# EAGLE schematic PowerBoard_v9 (EAGLE 9.7.0)
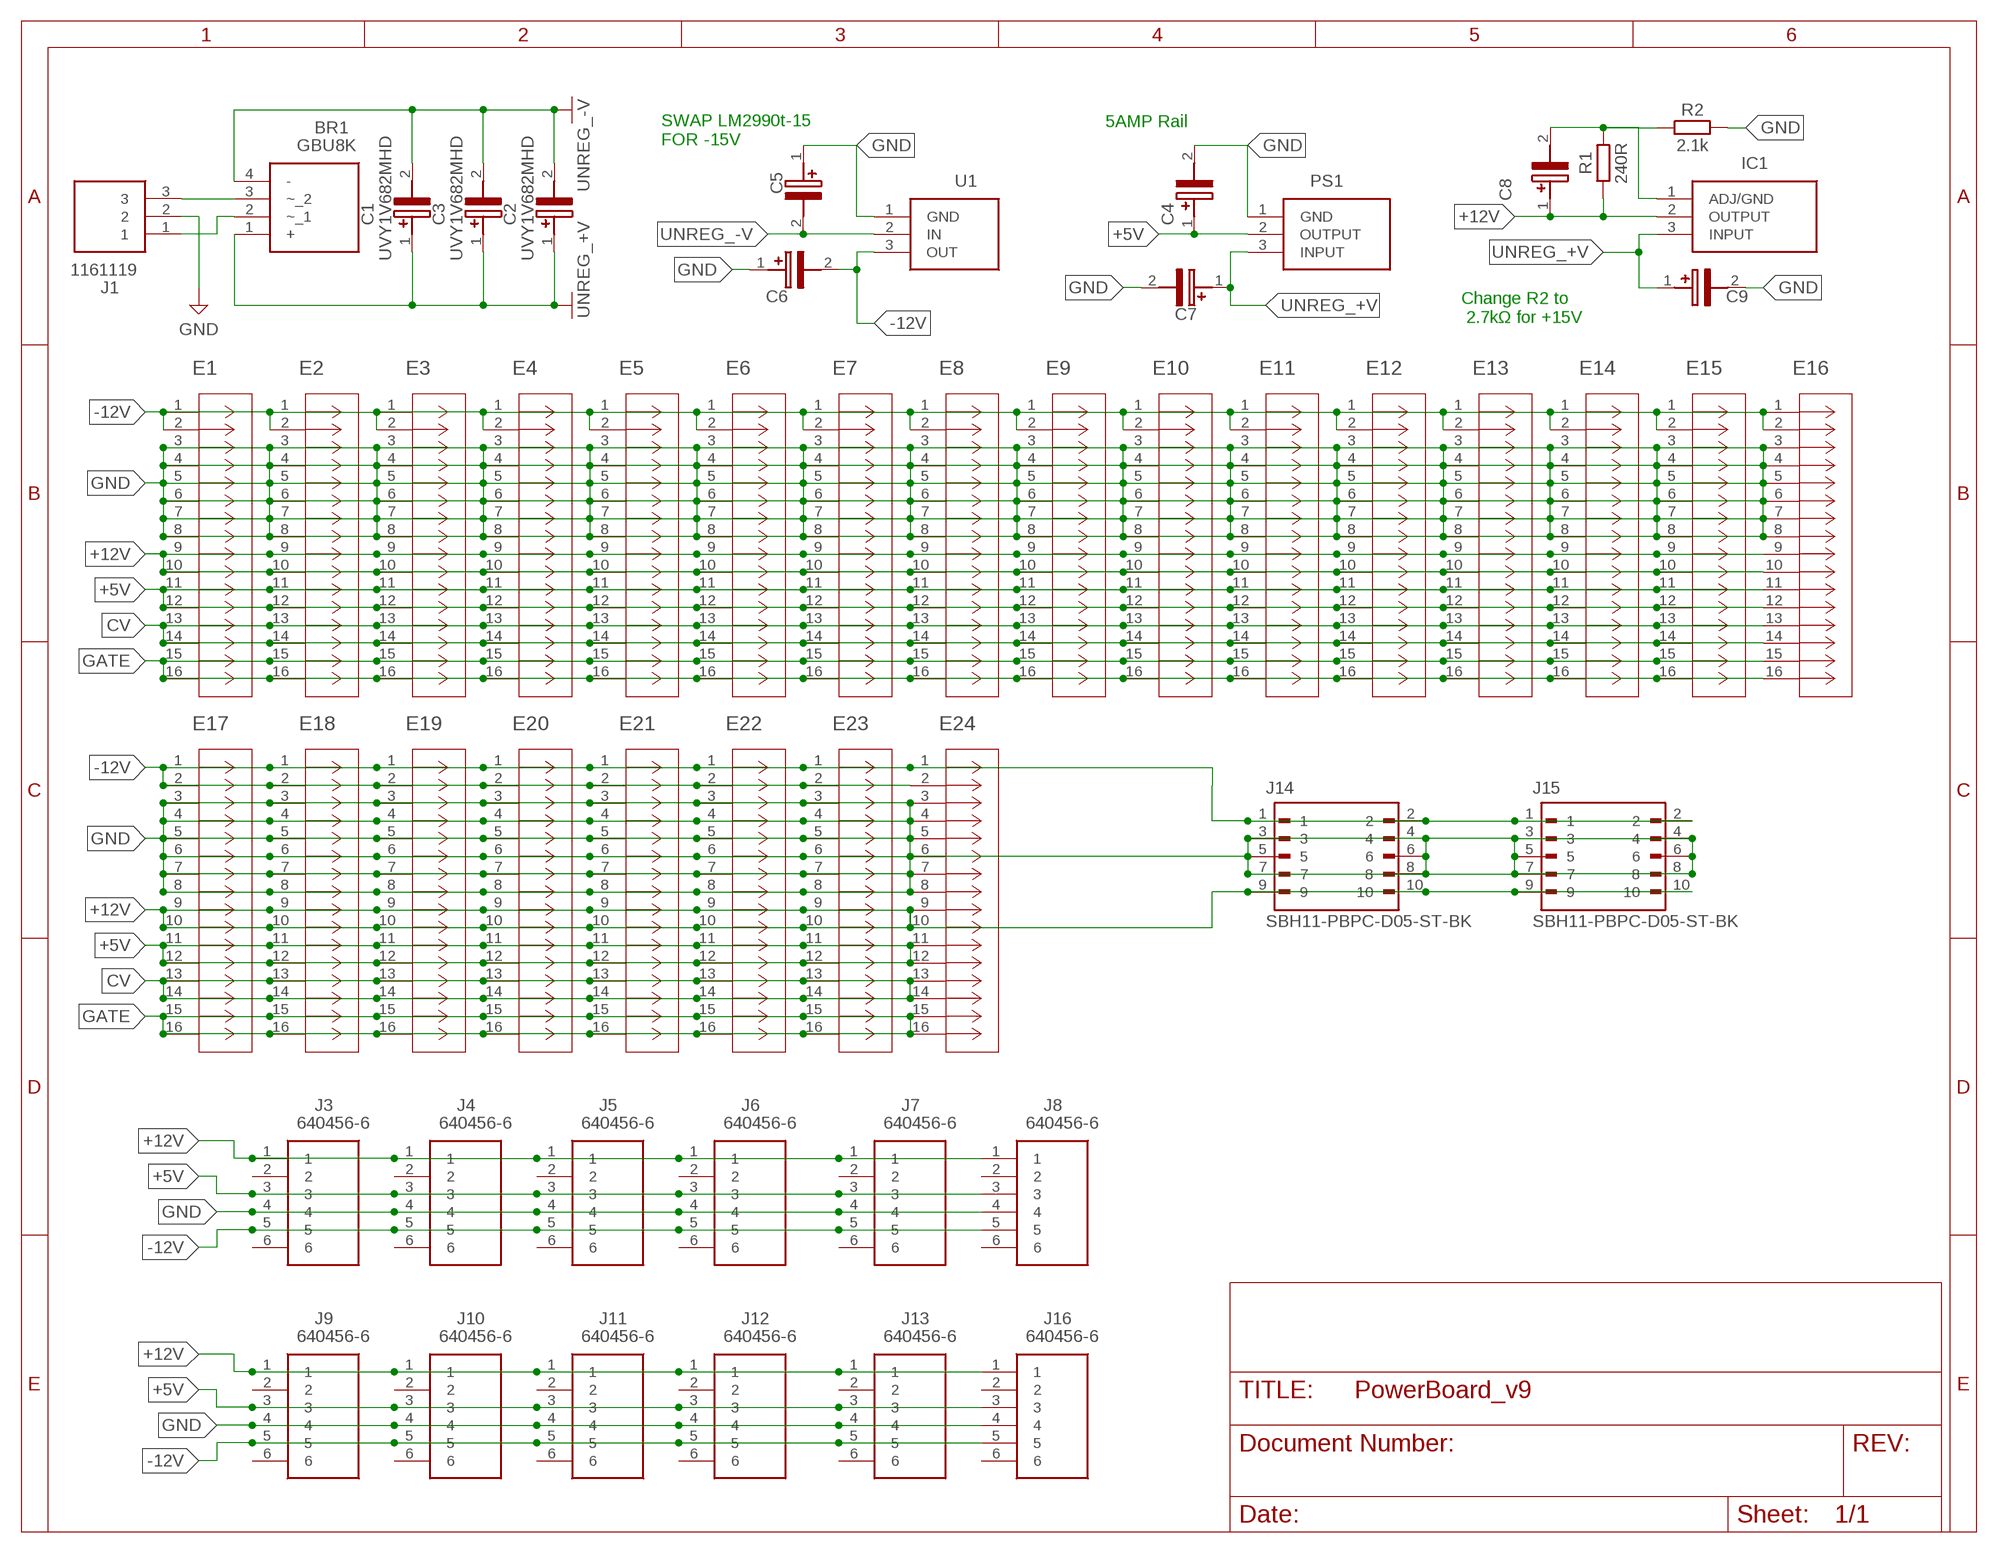
[diagram p0: schematic, sheet 1]

## Parts
BR1  GBU8K  [GBU8K]
C1  UVY1V682MHD  [CAPPRD750W80D1825H4200]
C2  UVY1V682MHD  [CAPPRD750W80D1825H4200]
C3  UVY1V682MHD  [CAPPRD750W80D1825H4200]
C4  UEP1V101MPD  [CAPPRD500W60D1025H1750]
C5  UEP1V101MPD  [CAPPRD500W60D1025H1750]
C6  UEP1V101MPD  [CAPPRD500W60D1025H1750]
C7  UEP1V101MPD  [CAPPRD500W60D1025H1750]
C8  UEP1V101MPD  [CAPPRD500W60D1025H1750]
C9  UEP1V101MPD  [CAPPRD500W60D1025H1750]
E1  SBH11-PBPC-D08-ST-BKCONN16_SBH11-PBPC-D08-ST-BK_SU  [CONN16_SBH11-PBPC-D08-ST-BK_SU]
E2  SBH11-PBPC-D08-ST-BKCONN16_SBH11-PBPC-D08-ST-BK_SU  [CONN16_SBH11-PBPC-D08-ST-BK_SU]
E3  SBH11-PBPC-D08-ST-BKCONN16_SBH11-PBPC-D08-ST-BK_SU  [CONN16_SBH11-PBPC-D08-ST-BK_SU]
E4  SBH11-PBPC-D08-ST-BKCONN16_SBH11-PBPC-D08-ST-BK_SU  [CONN16_SBH11-PBPC-D08-ST-BK_SU]
E5  SBH11-PBPC-D08-ST-BKCONN16_SBH11-PBPC-D08-ST-BK_SU  [CONN16_SBH11-PBPC-D08-ST-BK_SU]
E6  SBH11-PBPC-D08-ST-BKCONN16_SBH11-PBPC-D08-ST-BK_SU  [CONN16_SBH11-PBPC-D08-ST-BK_SU]
E7  SBH11-PBPC-D08-ST-BKCONN16_SBH11-PBPC-D08-ST-BK_SU  [CONN16_SBH11-PBPC-D08-ST-BK_SU]
E8  SBH11-PBPC-D08-ST-BKCONN16_SBH11-PBPC-D08-ST-BK_SU  [CONN16_SBH11-PBPC-D08-ST-BK_SU]
E9  SBH11-PBPC-D08-ST-BKCONN16_SBH11-PBPC-D08-ST-BK_SU  [CONN16_SBH11-PBPC-D08-ST-BK_SU]
E10  SBH11-PBPC-D08-ST-BKCONN16_SBH11-PBPC-D08-ST-BK_SU  [CONN16_SBH11-PBPC-D08-ST-BK_SU]
E11  SBH11-PBPC-D08-ST-BKCONN16_SBH11-PBPC-D08-ST-BK_SU  [CONN16_SBH11-PBPC-D08-ST-BK_SU]
E12  SBH11-PBPC-D08-ST-BKCONN16_SBH11-PBPC-D08-ST-BK_SU  [CONN16_SBH11-PBPC-D08-ST-BK_SU]
E13  SBH11-PBPC-D08-ST-BKCONN16_SBH11-PBPC-D08-ST-BK_SU  [CONN16_SBH11-PBPC-D08-ST-BK_SU]
E14  SBH11-PBPC-D08-ST-BKCONN16_SBH11-PBPC-D08-ST-BK_SU  [CONN16_SBH11-PBPC-D08-ST-BK_SU]
E15  SBH11-PBPC-D08-ST-BKCONN16_SBH11-PBPC-D08-ST-BK_SU  [CONN16_SBH11-PBPC-D08-ST-BK_SU]
E16  SBH11-PBPC-D08-ST-BKCONN16_SBH11-PBPC-D08-ST-BK_SU  [CONN16_SBH11-PBPC-D08-ST-BK_SU]
E17  SBH11-PBPC-D08-ST-BKCONN16_SBH11-PBPC-D08-ST-BK_SU  [CONN16_SBH11-PBPC-D08-ST-BK_SU]
E18  SBH11-PBPC-D08-ST-BKCONN16_SBH11-PBPC-D08-ST-BK_SU  [CONN16_SBH11-PBPC-D08-ST-BK_SU]
E19  SBH11-PBPC-D08-ST-BKCONN16_SBH11-PBPC-D08-ST-BK_SU  [CONN16_SBH11-PBPC-D08-ST-BK_SU]
E20  SBH11-PBPC-D08-ST-BKCONN16_SBH11-PBPC-D08-ST-BK_SU  [CONN16_SBH11-PBPC-D08-ST-BK_SU]
E21  SBH11-PBPC-D08-ST-BKCONN16_SBH11-PBPC-D08-ST-BK_SU  [CONN16_SBH11-PBPC-D08-ST-BK_SU]
E22  SBH11-PBPC-D08-ST-BKCONN16_SBH11-PBPC-D08-ST-BK_SU  [CONN16_SBH11-PBPC-D08-ST-BK_SU]
E23  SBH11-PBPC-D08-ST-BKCONN16_SBH11-PBPC-D08-ST-BK_SU  [CONN16_SBH11-PBPC-D08-ST-BK_SU]
E24  SBH11-PBPC-D08-ST-BKCONN16_SBH11-PBPC-D08-ST-BK_SU  [CONN16_SBH11-PBPC-D08-ST-BK_SU]
IC1  LM1084IT-ADJ_NOPB  [TO254P470X1028X1955-3P]
J1  1161119  [1161119]
J3  640456-6  [SHDR6W66P0X254_1X6_1524X572X10]
J4  640456-6  [SHDR6W66P0X254_1X6_1524X572X10]
J5  640456-6  [SHDR6W66P0X254_1X6_1524X572X10]
J6  640456-6  [SHDR6W66P0X254_1X6_1524X572X10]
J7  640456-6  [SHDR6W66P0X254_1X6_1524X572X10]
J8  640456-6  [SHDR6W66P0X254_1X6_1524X572X10]
J9  640456-6  [SHDR6W66P0X254_1X6_1524X572X10]
J10  640456-6  [SHDR6W66P0X254_1X6_1524X572X10]
J11  640456-6  [SHDR6W66P0X254_1X6_1524X572X10]
J12  640456-6  [SHDR6W66P0X254_1X6_1524X572X10]
J13  640456-6  [SHDR6W66P0X254_1X6_1524X572X10]
J14  SBH11-PBPC-D05-ST-BK  [SULLINS_SBH11-PBPC-D05-ST-BK]
J15  SBH11-PBPC-D05-ST-BK  [SULLINS_SBH11-PBPC-D05-ST-BK]
J16  640456-6  [SHDR6W66P0X254_1X6_1524X572X10]
PS1  LM1084IT-5.0_NOPB  [TO254P470X1028X1955-3P]
R1  240R  RESISTOR__AXIAL-7.2MM-PITCH  [RESAD724W46L381D178B]
R2  2.1k  RESISTOR__AXIAL-7.2MM-PITCH  [RESAD724W46L381D178B]
U1  LM2990T-12_NOPB  [TO254P470X1028X1955-3P]

## Nets
+5V: C4.1(+) E1.11 E1.12 E2.11 E2.12 E3.11 E3.12 E4.11 E4.12 E5.11 E5.12 E6.11 E6.12 E7.11 E7.12 E8.11 E8.12 E9.11 E9.12 E10.11 E10.12 E11.11 E11.12 E12.11 E12.12 E13.11 E13.12 E14.11 E14.12 E15.11 E15.12 E16.11 E16.12 E17.11 E17.12 E18.11 E18.12 E19.11 E19.12 E20.11 E20.12 E21.11 E21.12 E22.11 E22.12 E23.11 E23.12 E24.11 E24.12 J3.3 J4.3 J5.3 J6.3 J7.3 J8.3 J9.3 J10.3 J11.3 J12.3 J13.3 J16.3 PS1.2(OUTPUT)
+12V: C8.1(+) E1.9 E1.10 E2.9 E2.10 E3.9 E3.10 E4.9 E4.10 E5.9 E5.10 E6.9 E6.10 E7.9 E7.10 E8.9 E8.10 E9.9 E9.10 E10.9 E10.10 E11.9 E11.10 E12.9 E12.10 E13.9 E13.10 E14.9 E14.10 E15.9 E15.10 E16.9 E16.10 E17.9 E17.10 E18.9 E18.10 E19.9 E19.10 E20.9 E20.10 E21.9 E21.10 E22.9 E22.10 E23.9 E23.10 E24.9 E24.10 IC1.2(OUTPUT) J3.1 J4.1 J5.1 J6.1 J7.1 J8.1 J9.1 J10.1 J11.1 J12.1 J13.1 J14.9 J14.10 J15.9 J15.10 J16.1 R1.1
-12V: C6.2(-) E1.1 E1.2 E2.1 E2.2 E3.1 E3.2 E4.1 E4.2 E5.1 E5.2 E6.1 E6.2 E7.1 E7.2 E8.1 E8.2 E9.1 E9.2 E10.1 E10.2 E11.1 E11.2 E12.1 E12.2 E13.1 E13.2 E14.1 E14.2 E15.1 E15.2 E16.1 E16.2 E17.1 E17.2 E18.1 E18.2 E19.1 E19.2 E20.1 E20.2 E21.1 E21.2 E22.1 E22.2 E23.1 E23.2 E24.1 E24.2 J3.5 J4.5 J5.5 J6.5 J7.5 J8.5 J9.5 J10.5 J11.5 J12.5 J13.5 J14.1 J14.2 J15.1 J15.2 J16.5 U1.3(OUT)
CV: E1.13 E1.14 E2.13 E2.14 E3.13 E3.14 E4.13 E4.14 E5.13 E5.14 E6.13 E6.14 E7.13 E7.14 E8.13 E8.14 E9.13 E9.14 E10.13 E10.14 E11.13 E11.14 E12.13 E12.14 E13.13 E13.14 E14.13 E14.14 E15.13 E15.14 E16.13 E16.14 E17.13 E17.14 E18.13 E18.14 E19.13 E19.14 E20.13 E20.14 E21.13 E21.14 E22.13 E22.14 E23.13 E23.14 E24.13 E24.14
GATE: E1.15 E1.16 E2.15 E2.16 E3.15 E3.16 E4.15 E4.16 E5.15 E5.16 E6.15 E6.16 E7.15 E7.16 E8.15 E8.16 E9.15 E9.16 E10.15 E10.16 E11.15 E11.16 E12.15 E12.16 E13.15 E13.16 E14.15 E14.16 E15.15 E15.16 E16.15 E16.16 E17.15 E17.16 E18.15 E18.16 E19.15 E19.16 E20.15 E20.16 E21.15 E21.16 E22.15 E22.16 E23.15 E23.16 E24.15 E24.16
GND: C4.2(-) C5.1(+) C6.1(+) C7.2(-) C9.2(-) E1.3 E1.4 E1.5 E1.6 E1.7 E1.8 E2.3 E2.4 E2.5 E2.6 E2.7 E2.8 E3.3 E3.4 E3.5 E3.6 E3.7 E3.8 E4.3 E4.4 E4.5 E4.6 E4.7 E4.8 E5.3 E5.4 E5.5 E5.6 E5.7 E5.8 E6.3 E6.4 E6.5 E6.6 E6.7 E6.8 E7.3 E7.4 E7.5 E7.6 E7.7 E7.8 E8.3 E8.4 E8.5 E8.6 E8.7 E8.8 E9.3 E9.4 E9.5 E9.6 E9.7 E9.8 E10.3 E10.4 E10.5 E10.6 E10.7 E10.8 E11.3 E11.4 E11.5 E11.6 E11.7 E11.8 E12.3 E12.4 E12.5 E12.6 E12.7 E12.8 E13.3 E13.4 E13.5 E13.6 E13.7 E13.8 E14.3 E14.4 E14.5 E14.6 E14.7 E14.8 E15.3 E15.4 E15.5 E15.6 E15.7 E15.8 E16.3 E16.4 E16.5 E16.6 E16.7 E16.8 E17.3 E17.4 E17.5 E17.6 E17.7 E17.8 E18.3 E18.4 E18.5 E18.6 E18.7 E18.8 E19.3 E19.4 E19.5 E19.6 E19.7 E19.8 E20.3 E20.4 E20.5 E20.6 E20.7 E20.8 E21.3 E21.4 E21.5 E21.6 E21.7 E21.8 E22.3 E22.4 E22.5 E22.6 E22.7 E22.8 E23.3 E23.4 E23.5 E23.6 E23.7 E23.8 E24.3 E24.4 E24.5 E24.6 E24.7 E24.8 J1.2 J3.4 J4.4 J5.4 J6.4 J7.4 J8.4 J9.4 J10.4 J11.4 J12.4 J13.4 J14.3 J14.4 J14.5 J14.6 J14.7 J14.8 J15.3 J15.4 J15.5 J15.6 J15.7 J15.8 J16.4 PS1.1(GND) R2.2 U1.1(GND)
N$1: BR1.3(~_2) J1.3
N$2: BR1.2(~_1) J1.1
N$4: C8.2(-) IC1.1(ADJ/GND) R1.2 R2.1
UNREG_+V: BR1.1(+) C1.1(+) C2.1(+) C3.1(+) C7.1(+) C9.1(+) IC1.3(INPUT) PS1.3(INPUT)
UNREG_-V: BR1.4(-) C1.2(-) C2.2(-) C3.2(-) C5.2(-) U1.2(IN)
Unconnected: J3.2 J3.6 J4.2 J4.6 J5.2 J5.6 J6.2 J6.6 J7.2 J7.6 J8.2 J8.6 J9.2 J9.6 J10.2 J10.6 J11.2 J11.6 J12.2 J12.6 J13.2 J13.6 J16.2 J16.6

## Notes on the sheet
- 5AMP Rail
- SWAP LM2990t-15
  FOR -15V
- Change R2 to
   2.7kΩ for +15V

## Library data of the parts
BR1 = GBU8K:GBU8K: Glass-Passivated Junction; Reliable Low-Cost Construction Utilizing Molded Plastic Technique; Ideal for Printed Circuit Bboard; UL certified, UL #E258596; Surge Overload Rating: 200 A peak Source: Datasheet <https://www.onsemi.com/pub/Collateral/GBU8B-D.PDF>; DESCRIPTION: Glass-Passivated Junction; Reliable Low-Cost Construction Utilizing Molded Plastic Technique; Ideal for Printed Circuit Bboard; UL certified, UL #E258596; Surge Overload Rating: 200 A peak; HEIGHT: 18.8mm; MANUFACTURER_NAME: onsemi; MANUFACTURER_PART_NUMBER: GBU8K; MOUSER_PART_NUMBER: 512-GBU8K; MOUSER_PRICE-STOCK: https://www.mouser.co.uk/ProductDetail/onsemi-Fairchild/GBU8K?qs=y841m8McC1Zm%2F8rGO9q6tw%3D%3D
C1-C3 = UVY1V682MHD:UVY1V682MHD: Aluminum Electrolytic Capacitors - Radial Leaded 35volts 6800uF 18x40 20% 7.5LS Source: Datasheet <https://www.nichicon.co.jp/english/series_items/catalog_pdf/e-uvy.pdf>; DESCRIPTION: Aluminum Electrolytic Capacitors - Radial Leaded 35volts 6800uF 18x40 20% 7.5LS; HEIGHT: 42mm; MANUFACTURER_NAME: Nichicon; MANUFACTURER_PART_NUMBER: UVY1V682MHD; MOUSER_PART_NUMBER: 647-UVY1V682MHD; MOUSER_PRICE-STOCK: https://www.mouser.co.uk/ProductDetail/Nichicon/UVY1V682MHD?qs=03MsczUQpDSvOkW22EYEfQ%3D%3D
C4-C9 = UEP1V101MPD:UEP1V101MPD: Aluminum Electrolytic Capacitors - Radial Leaded 35volts 100uF 0.2L/S Source: Datasheet; DESCRIPTION: Aluminum Electrolytic Capacitors - Radial Leaded 35volts 100uF 0.2L/S; HEIGHT: 17.5mm; MANUFACTURER_NAME: Nichicon; MANUFACTURER_PART_NUMBER: UEP1V101MPD; MOUSER_PART_NUMBER: 647-UEP1V101MPD; MOUSER_PRICE-STOCK: https://www.mouser.co.uk/ProductDetail/Nichicon/UEP1V101MPD?qs=bwWQAIe1w651dkL62BtnuQ%3D%3D
E1-E24 = 2025-05-25_01-48-17_Library:SBH11-PBPC-D08-ST-BK; COPYRIGHT: Copyright (C) 2025 Ultra Librarian. All rights reserved.; MANUFACTURER_PART_NUMBER: SBH11-PBPC-D08-ST-BK; MFR_NAME: Sullins; TYPE: Headers, Male Pins
IC1 = LM1084IT-ADJ_NOPB:LM1084IT-ADJ_NOPB: 5A Fixed / Adjustable Output Linear Regulator Source: Datasheet <http://www.ti.com/lit/gpn/lm1084>; DESCRIPTION: 5A Fixed / Adjustable Output Linear Regulator; HEIGHT: 4.7mm; MANUFACTURER_NAME: Texas Instruments; MANUFACTURER_PART_NUMBER: LM1084IT-ADJ/NOPB; MOUSER_PART_NUMBER: 926-LM1084IT-ADJNOPB; MOUSER_PRICE-STOCK: https://www.mouser.co.uk/ProductDetail/Texas-Instruments/LM1084IT-ADJ-NOPB?qs=X1J7HmVL2ZFnaHQkkplutQ%3D%3D
J1 = 1161119:1161119: Pluggable Terminal Blocks MKDSN 1,5/ 3-5,08 MCBD:+-S Source: Datasheet <http://www.phoenixcontact.net/product/1161119>; DESCRIPTION: Pluggable Terminal Blocks MKDSN 1,5/ 3-5,08 MCBD:+-S; HEIGHT: 10.15mm; MANUFACTURER_NAME: Phoenix Contact; MANUFACTURER_PART_NUMBER: 1161119; MOUSER_PART_NUMBER: 651-1161119; MOUSER_PRICE-STOCK: https://www.mouser.co.uk/ProductDetail/Phoenix-Contact/1161119?qs=Wj%2FVkw3K%252BMBiMbL7Hej3PA%3D%3D
J3-J13 J16 = 640456-6:640456-6: Body Features: Primary Product Color Natural | Configuration Features: Number of Rows 1 | Number of Columns 6 | PCB Mount Orientation Vertical | Number of Positions 6 | Contact Features: Contact Underplating Material Thickness 50 MICIN | Contact Underplating Material Thickness 1.27 MICM | Mating Square Post Dimension .64 MM | Contact Layout Inline | Contact Mating Area Length .295 INCH | Contact Mating Area Plating Material Thickness 3.81 MICM | Contact Base Material Copper Alloy | Contact Mating Area Plati Source: Datasheet <https://datasheet.datasheetarchive.com/originals/distributors/Datasheets_SAMA/53b6d75d7446c4158b7609f45acef8cd.pdf>; DESCRIPTION: Body Features: Primary Product Color Natural | Configuration Features: Number of Rows 1 | Number of Columns 6 | PCB Mount Orientation Vertical | Number of Positions 6 | Contact Features: Contact Underplating Material Thickness 50 MICIN | Contact Underplating Material Thickness 1.27 MICM | Mating Square Post Dimension .64 MM | Contact Layout Inline | Contact Mating Area Length .295 INCH | Contact Mating Area Plating Material Thickness 3.81 MICM | Contact Base Material Copper Alloy | Contact Mating Area Plati; HEIGHT: 10.033mm; MANUFACTURER_NAME: TE Connectivity; MANUFACTURER_PART_NUMBER: 640456-6; MOUSER_PART_NUMBER: 571-6404566; MOUSER_PRICE-STOCK: https://www.mouser.co.uk/ProductDetail/TE-Connectivity-AMP/640456-6?qs=%2F35zJ5USjomb%252BGgX%252BBnrrQ%3D%3D
J14 J15 = SBH11-PBPC-D05-ST-BK:SBH11-PBPC-D05-ST-BK; MANUFACTURER: Sullins Connector Solutions; MAXIMUM_PACKAGE_HEIGHT: 9.1mm; PARTREV: J; SNAPEDA_PN: SBH11-PBPC-D05-ST-BK; STANDARD: Manufacturer Recommendations
PS1 = LM1084IT-5.0_NOPB:LM1084IT-5.0_NOPB: 5A Fixed / Adjustable Output Linear Regulator Source: Datasheet <http://www.ti.com/lit/gpn/lm1084>; DESCRIPTION: 5A Fixed / Adjustable Output Linear Regulator; HEIGHT: 4.7mm; MANUFACTURER_NAME: Texas Instruments; MANUFACTURER_PART_NUMBER: LM1084IT-5.0/NOPB; MOUSER_PART_NUMBER: 926-LM1084IT50NOPB; MOUSER_PRICE-STOCK: https://www.mouser.co.uk/ProductDetail/Texas-Instruments/LM1084IT-5.0-NOPB?qs=X1J7HmVL2ZG3q7gVwoDmcw%3D%3D
R1 R2 = Tinkercad:RESISTOR: Resistor Fixed - Generic; CATEGORY: Resistor; SUB-CATEGORY: Fixed
U1 = LM2990T-12_NOPB:LM2990T-12_NOPB: Texas Instruments LM2990T-12/NOPB, LDO Voltage Regulator, 1A, -12 V +/-5%, -26 0.3 Vin, 3-Pin TO-220 Source: Datasheet <http://www.ti.com/lit/gpn/lm2990>; DESCRIPTION: Texas Instruments LM2990T-12/NOPB, LDO Voltage Regulator, 1A, -12 V +/-5%, -26 0.3 Vin, 3-Pin TO-220; HEIGHT: 4.7mm; MANUFACTURER_NAME: Texas Instruments; MANUFACTURER_PART_NUMBER: LM2990T-12/NOPB; MOUSER_PART_NUMBER: 926-LM2990T-12/NOPB; MOUSER_PRICE-STOCK: https://www.mouser.co.uk/ProductDetail/Texas-Instruments/LM2990T-12-NOPB?qs=X1J7HmVL2ZF9B8sa0Zh01w%3D%3D